# Altium project v7-9BProto-cpu.PrjPCB
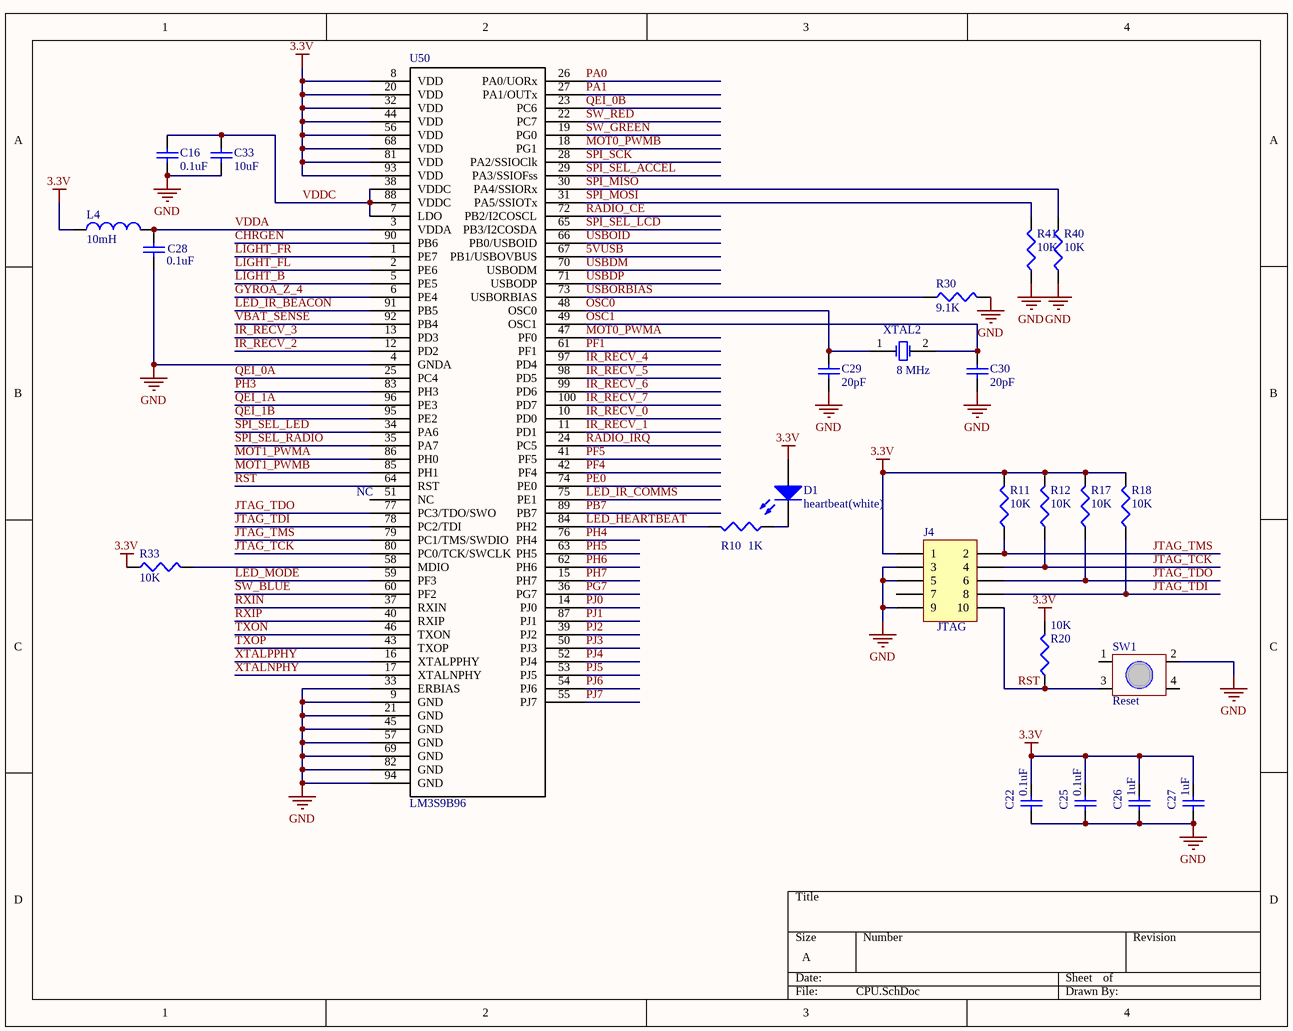
[diagram p0: CPU.SchDoc]
6 sheets, 133 parts. Net scope: global (net labels, ports and power ports of the same name join across sheets).
Board file: v0-9Bcpu.PcbDoc
Sheets:
  CPU.SchDoc
  USB_Headers.SchDoc
  IRComms.SchDoc
  LEDs.SchDoc
  Radio.SchDoc
  LightSensors_Buttons_LCD.SchDoc

## Sheet CPU.SchDoc
size A

### Parts
C16  value 0.1uF  [CAPC1005L]  (hidden comment: Cap Semi)
C22  value 0.1uF  [CAPC1005L]  (hidden comment: Cap Semi)
C25  value 0.1uF  [CAPC1005L]  (hidden comment: Cap Semi)
C26  value 1uF  [CAPC1608L]  (hidden comment: Cap Semi)
C27  value 1uF  [CAPC1608L]  (hidden comment: Cap Semi)
C28  value 0.1uF  [CAPC1005L]  (hidden comment: Cap Semi)
C29  value 20pF  [CAPC1005L]  (hidden comment: Cap Semi)
C30  value 20pF  [CAPC1005L]  (hidden comment: Cap Semi)
C33  value 10uF  [CAPC1005L]  (hidden comment: Cap Semi)
D1  heartbeat(white)  [INDC2012L]
J4  JTAG  [JTAG-10]
L4  value 10mH  [INDC2012L]  (hidden comment: Inductor)
R10  value 1K  [RESC1608L]  (hidden comment: Res3)
R11  value 10K  [RESC1608L]  (hidden comment: Res3)
R12  value 10K  [RESC1608L]  (hidden comment: Res3)
R17  value 10K  [RESC1608L]  (hidden comment: Res3)
R18  value 10K  [RESC1608L]  (hidden comment: Res3)
R20  value 10K  [RESC1608L]  (hidden comment: Res3)
R30  value 9.1K  [RESC1608L]  (hidden comment: Res3)
R33  value 10K  [RESC1608L]  (hidden comment: Res3)
R40  value 10K  [RESC1608L]  (hidden comment: Res3)
R41  value 10K  [RESC1608L]  (hidden comment: Res3)
SW1  Reset  [SwitchTall-TL330]
U50  LM3S9B96  [LQFP-100]
XTAL2  8 MHz  [RESC5025L]

### Nets
3.3V: C22.2 C25.2 C26.2 C27.2 D1.1(A) J4.1 L4.1 R11.2 R12.2 R17.2 R18.2 R20.2 R33.1 U50.8(VDD) U50.20(VDD) U50.32(VDD) U50.44(VDD) U50.56(VDD) U50.68(VDD) U50.81(VDD) U50.93(VDD)
GND: C16.1 C22.1 C25.1 C26.1 C27.1 C28.1 C29.1 C30.1 C33.1 J4.3 J4.5 J4.9 R30.2 R40.1 R41.1 SW1.2 U50.4(GNDA) U50.9(GND) U50.21(GND) U50.33(ERBIAS) U50.45(GND) U50.57(GND) U50.69(GND) U50.82(GND) U50.94(GND)
5VUSB: U50.67(PB1/USBOVBUS)
CHRGEN: U50.90(PB6)
GYROA_Z_4: U50.6(PE4)
IR_RECV_0: U50.10(PD0)
IR_RECV_1: U50.11(PD1)
IR_RECV_2: U50.12(PD2)
IR_RECV_3: U50.13(PD3)
IR_RECV_4: U50.97(PD4)
IR_RECV_5: U50.98(PD5)
IR_RECV_6: U50.99(PD6)
IR_RECV_7: U50.100(PD7)
JTAG_TCK: J4.4 R12.1 U50.80(PC0/TCK/SWCLK)
JTAG_TDI: J4.8 R18.1 U50.78(PC2/TDI)
JTAG_TDO: J4.6 R17.1 U50.77(PC3/TDO/SWO)
JTAG_TMS: J4.2 R11.1 U50.79(PC1/TMS/SWDIO)
LED_HEARTBEAT: R10.2 U50.84(PH2)
LED_IR_BEACON: U50.91(PB5)
LED_IR_COMMS: U50.75(PE1)
LED_MODE: U50.59(PF3)
LIGHT_B: U50.5(PE5)
LIGHT_FL: U50.2(PE6)
LIGHT_FR: U50.1(PE7)
MOT0_PWMA: U50.47(PF0)
MOT0_PWMB: U50.18(PG1)
MOT1_PWMA: U50.86(PH0)
MOT1_PWMB: U50.85(PH1)
OSC0: C29.2 U50.48(OSC0) XTAL2.1(OSC1)
OSC1: C30.2 U50.49(OSC1) XTAL2.2(OSC2)
PA0: U50.26(PA0/UORx)
PA1: U50.27(PA1/OUTx)
PB7: U50.89(PB7)
PE0: U50.74(PE0)
PF1: U50.61(PF1)
PF4: U50.42(PF4)
PF5: U50.41(PF5)
PG7: U50.36(PG7)
PH3: U50.83(PH3)
PH4: U50.76(PH4)
PH5: U50.63(PH5)
PH6: U50.62(PH6)
PH7: U50.15(PH7)
PJ0: U50.14(PJ0)
PJ1: U50.87(PJ1)
PJ2: U50.39(PJ2)
PJ3: U50.50(PJ3)
PJ4: U50.52(PJ4)
PJ5: U50.53(PJ5)
PJ6: U50.54(PJ6)
PJ7: U50.55(PJ7)
QEI_0A: U50.25(PC4)
QEI_0B: U50.23(PC6)
QEI_1A: U50.96(PE3)
QEI_1B: U50.95(PE2)
RADIO_CE: U50.72(PB2/I2COSCL)
RADIO_IRQ: U50.24(PC5)
RST: J4.10 R20.1 SW1.3 U50.64(RST)
RXIN: U50.37(RXIN)
RXIP: U50.40(RXIP)
SPI_MISO: R40.2 U50.30(PA4/SSIORx)
SPI_MOSI: R41.2 U50.31(PA5/SSIOTx)
SPI_SCK: U50.28(PA2/SSIOClk)
SPI_SEL_ACCEL: U50.29(PA3/SSIOFss)
SPI_SEL_LCD: U50.65(PB3/I2COSDA)
SPI_SEL_LED: U50.34(PA6)
SPI_SEL_RADIO: U50.35(PA7)
SW_BLUE: U50.60(PF2)
SW_GREEN: U50.19(PG0)
SW_RED: U50.22(PC7)
TXON: U50.46(TXON)
TXOP: U50.43(TXOP)
USBDM: U50.70(USBODM)
USBDP: U50.71(USBODP)
USBOID: U50.66(PB0/USBOID)
USBORBIAS: R30.1 U50.73(USBORBIAS)
VBAT_SENSE: U50.92(PB4)
VDDA: C28.2 L4.2 U50.3(VDDA)
VDDC: C16.2 C33.2 U50.7(LDO) U50.38(VDDC) U50.88(VDDC)
XTALNPHY: U50.17(XTALNPHY)
XTALPPHY: U50.16(XTALPPHY)
NetD1_2: D1.2(K) R10.1
NetR33_2: R33.2 U50.58(MDIO)

Not connected (* = marked no-connect by the designer): J4 7; SW1 1 4; U50 51(NC)

### Notes on the sheet
- (near U50) NC

### Library data of the parts
C16 C22 C25-C30 C33 = Cap Semi: Capacitor (Semiconductor SIM Model); Published: 8-Jun-2000; LatestRevisionDate: 29-May-2009; LatestRevisionNote: IPC-7351 Footprint Added.; PackageReference: C1206; Publisher: Altium Limited; PackageDescription: Chip Capacitor
D1 = LED2: Typical RED, GREEN, YELLOW, AMBER GaAs LED; Published: 8-Jun-2000; LatestRevisionDate: 17-Jul-2002; LatestRevisionNote: Re-released for DXP Platform.; PackageVersion: Feb-2002; PackageReference: 3.2X1.6X1.1; Publisher: Altium Limited
J4 = Header 5X2H: Header, 5-Pin, Dual row, Right Angle; LatestRevisionDate: 17-Jul-2002; LatestRevisionNote: Re-released for DXP Platform.; Publisher: Altium Limited
L4 = Inductor: Code_IEC: 1005; Published: 8-Jun-2000; LatestRevisionDate: 29-May-2009; LatestRevisionNote: IPC-7351 Footprint Added.; PackageReference: 0402-A; Publisher: Altium Limited; PackageDescription: Chip Inductor; Code_JEITA: 0402
R10-R12 R17 R18 R20 R30 R33 R40 R41 = Res3: Resistor; Published: 8-Jun-2000; LatestRevisionDate: 29-May-2009; LatestRevisionNote: IPC-7351 Footprint Added.; PackageReference: J1-0603; Publisher: Altium Limited; PackageDescription: Chip Resistor
SW1 = Switch-TL330
XTAL2 = XTAL: Crystal Oscillator; Published: 8-Jun-2000; LatestRevisionDate: 17-Jul-2002; LatestRevisionNote: Re-released for DXP Platform.; PackageReference: R38; Publisher: Altium Limited

## Sheet USB_Headers.SchDoc
size A
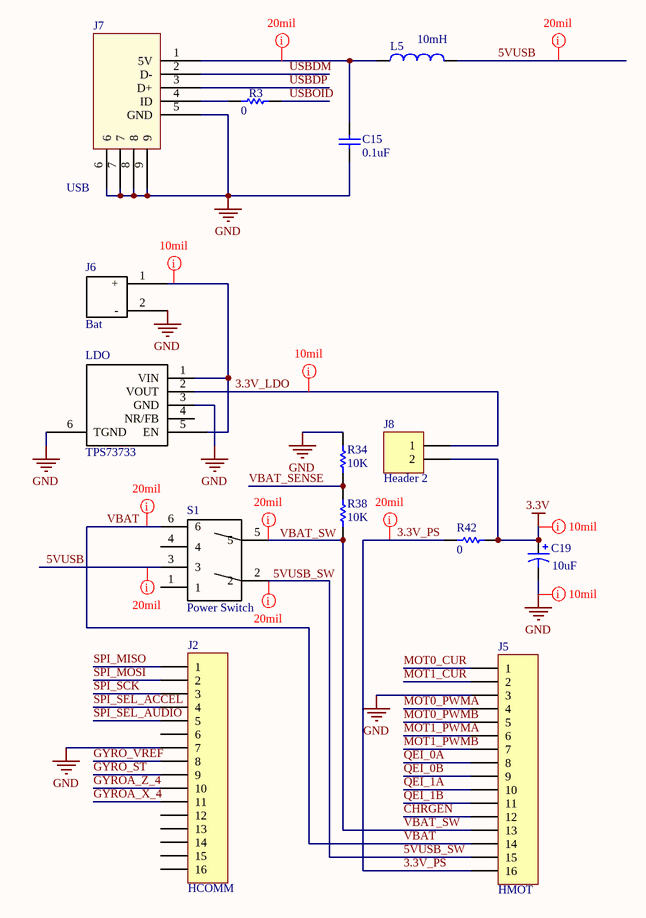
[diagram p1: USB_Headers.SchDoc]

### Parts
C15  value 0.1uF  [CAPC1005L]
C19  value 10uF  [CAPC3216L]  (hidden comment: Cap Pol3)
J2  HCOMM  [HDR1X16]
J5  HMOT  [HDR1X16]
J6  Bat  [BatteryConnJST]
J7  USB  [USB Minib (thru-hole)]
J8  Header 2  [HDR1X2]
L5  value 10mH  [INDC2012L]  (hidden comment: Inductor)
LDO  TPS73733  [SOT-223-5pin]
R3  value 0  [RESC1608L]
R34  value 10K  [RESC1608L]
R38  value 10K  [RESC1608L]
R42  value 0  [RESC3216L]
S1  Power Switch  [DPDTSwitch]

### Nets
3.3V: C19.1 J8.2 R42.2
GND: C15.1 C19.2 J2.7 J5.3 J6.2(-) J7.5(GND) J7.6 J7.7 J7.8 J7.9 LDO.3(GND) LDO.6(TGND) R34.2
3.3V_LDO: J8.1 LDO.2(VOUT)
3.3V_PS: J5.16 R42.1
5VUSB: L5.2 S1.3
5VUSB_SW: J5.15 S1.2
CHRGEN: J5.12
GYRO_ST: J2.9
GYRO_VREF: J2.8
GYROA_X_4: J2.11
GYROA_Z_4: J2.10
MOT0_CUR: J5.1
MOT0_PWMA: J5.4
MOT0_PWMB: J5.5
MOT1_CUR: J5.2
MOT1_PWMA: J5.6
MOT1_PWMB: J5.7
QEI_0A: J5.8
QEI_0B: J5.9
QEI_1A: J5.10
QEI_1B: J5.11
SPI_MISO: J2.1
SPI_MOSI: J2.2
SPI_SCK: J2.3
SPI_SEL_ACCEL: J2.4
SPI_SEL_AUDIO: J2.5
USBDM: J7.2(D-)
USBDP: J7.3(D+)
USBOID: R3.1
VBAT: J5.14 S1.6
VBAT_SENSE: R34.1 R38.2
VBAT_SW: J5.13 R38.1 S1.5
NetC15_2: C15.2 J7.1(5V) L5.1
NetJ6_1: J6.1(+) LDO.1(VIN) LDO.5(EN)
NetJ7_4: J7.4(ID) R3.2

Not connected (* = marked no-connect by the designer): J2 6 12 13 14 15 16; LDO 4(NR/FB); S1 1 4

### Layout directives
rule Width Constraint [Pref Width = 10mil    Min Width = 10mil    Max Width = 20mil]: 3.3V, 3.3V_PS, 5VUSB, 5VUSB_SW, GND, NetC15_2, VBAT, VBAT_SW
rule Width Constraint [Pref Width = 10mil    Min Width = 10mil    Max Width = 10mil]: 3.3V_LDO, NetJ6_1

### Notes on the sheet
- Labels drawn without touching a wire or pin: 5VUSB_SW, VBAT_SW

### Library data of the parts
C15 = Cap: Capacitor; Published: 8-Jun-2000; LatestRevisionDate: 17-Jul-2002; LatestRevisionNote: Re-released for DXP Platform.; PackageReference: RAD-0.3; Publisher: Altium Limited
C19 = Cap Pol3: Polarized Capacitor (Surface Mount); Published: 8-Jun-2000; LatestRevisionDate: 29-May-2009; LatestRevisionNote: IPC-7351 Footprint Added.; PackageReference: C0805; Publisher: Altium Limited; PackageDescription: Chip Capacitor
J2 J5 = Header 16: Header, 16-Pin; LatestRevisionDate: 17-Jul-2002; LatestRevisionNote: Re-released for DXP Platform.; Publisher: Altium Limited
J6 = BatteryConnJST
J7 = USB-ConnTH
J8 = Header 2: Header, 2-Pin; LatestRevisionDate: 17-Jul-2002; LatestRevisionNote: Re-released for DXP Platform.; Publisher: Altium Limited
L5 = Inductor: Code_IEC: 1005; Published: 8-Jun-2000; LatestRevisionDate: 29-May-2009; LatestRevisionNote: IPC-7351 Footprint Added.; PackageReference: 0402-A; Publisher: Altium Limited; PackageDescription: Chip Inductor; Code_JEITA: 0402
LDO = LDO33-TI-TPS73733
R3 R34 R38 R42 = Res1: Resistor; Published: 8-Jun-2000; LatestRevisionDate: 17-Jul-2002; LatestRevisionNote: Re-released for DXP Platform.; PackageReference: AXIAL-0.3; Publisher: Altium Limited
S1 = DPDTSwitch

## Sheet IRComms.SchDoc
size A
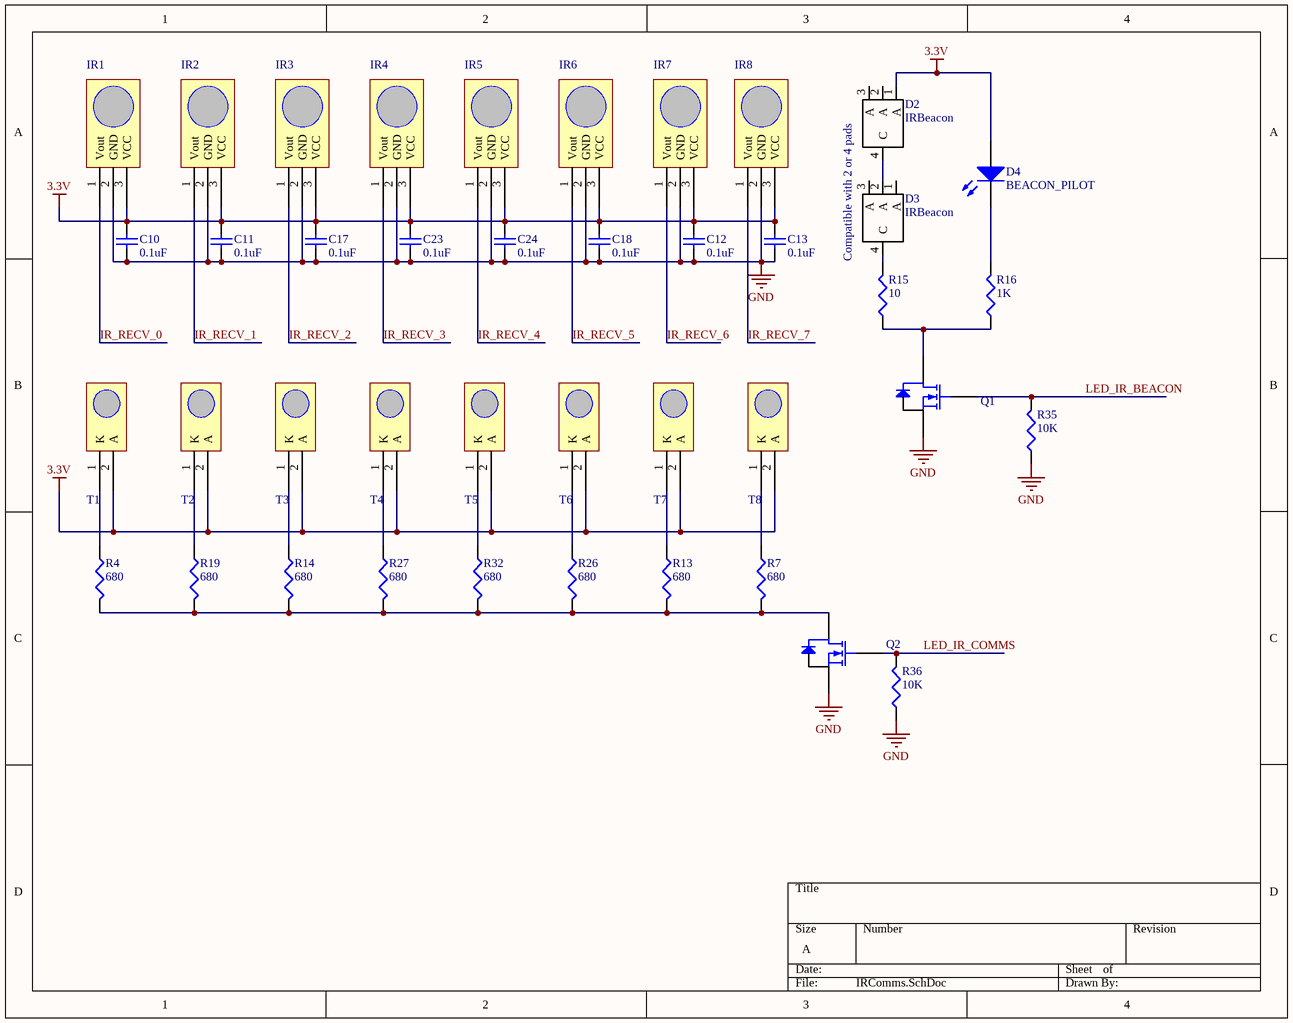
[diagram p2: IRComms.SchDoc]

### Parts
C10  value 0.1uF  [CAPC1005L]  (hidden comment: Cap Semi)
C11  value 0.1uF  [CAPC1005L]  (hidden comment: Cap Semi)
C12  value 0.1uF  [CAPC1005L]  (hidden comment: Cap Semi)
C13  value 0.1uF  [CAPC1005L]  (hidden comment: Cap Semi)
C17  value 0.1uF  [CAPC1005L]  (hidden comment: Cap Semi)
C18  value 0.1uF  [CAPC1005L]  (hidden comment: Cap Semi)
C23  value 0.1uF  [CAPC1005L]  (hidden comment: Cap Semi)
C24  value 0.1uF  [CAPC1005L]  (hidden comment: Cap Semi)
D2  IRBeacon  [IRBeacon]
D3  IRBeacon  [IRBeacon]
D4  BEACON_PILOT  [SurfaceMount(603)]
IR1  GP1UX31QS  [GP1UX31QS]  (value not drawn)
IR2  GP1UX31QS  [GP1UX31QS]  (value not drawn)
IR3  GP1UX31QS  [GP1UX31QS]  (value not drawn)
IR4  GP1UX31QS  [GP1UX31QS]  (value not drawn)
IR5  GP1UX31QS  [GP1UX31QS]  (value not drawn)
IR6  GP1UX31QS  [GP1UX31QS]  (value not drawn)
IR7  GP1UX31QS  [GP1UX31QS]  (value not drawn)
IR8  GP1UX31QS  [GP1UX31QS]  (value not drawn)
Q1  Mosfet  [SOT-23]  (value not drawn)
Q2  Mosfet  [SOT-23]  (value not drawn)
R4  value 680  [RESC1608L]  (hidden comment: Res3)
R7  value 680  [RESC1608L]  (hidden comment: Res3)
R13  value 680  [RESC1608L]  (hidden comment: Res3)
R14  value 680  [RESC1608L]  (hidden comment: Res3)
R15  value 10  [RESC1608L]  (hidden comment: Res3)
R16  value 1K  [RESC1608L]  (hidden comment: Res3)
R19  value 680  [RESC1608L]  (hidden comment: Res3)
R26  value 680  [RESC1608L]  (hidden comment: Res3)
R27  value 680  [RESC1608L]  (hidden comment: Res3)
R32  value 680  [RESC1608L]  (hidden comment: Res3)
R35  value 10K  [RESC1608L]  (hidden comment: Res3)
R36  value 10K  [RESC1608L]  (hidden comment: Res3)
T1  LN54  [LN54]  (value not drawn)
T2  LN54  [LN54]  (value not drawn)
T3  LN54  [LN54]  (value not drawn)
T4  LN54  [LN54]  (value not drawn)
T5  LN54  [LN54]  (value not drawn)
T6  LN54  [LN54]  (value not drawn)
T7  LN54  [LN54]  (value not drawn)
T8  LN54  [LN54]  (value not drawn)

### Nets
3.3V: C10.2 C11.2 C12.2 C13.2 C17.2 C18.2 C23.2 C24.2 D2.1(A) D4.1(A) IR1.3(VCC) IR2.3(VCC) IR3.3(VCC) IR4.3(VCC) IR5.3(VCC) IR6.3(VCC) IR7.3(VCC) IR8.3(VCC) T1.2(A) T2.2(A) T3.2(A) T4.2(A) T5.2(A) T6.2(A) T7.2(A) T8.2(A)
GND: C10.1 C11.1 C12.1 C13.1 C17.1 C18.1 C23.1 C24.1 IR1.2(GND) IR2.2(GND) IR3.2(GND) IR4.2(GND) IR5.2(GND) IR6.2(GND) IR7.2(GND) IR8.2(GND) Q1.2(S) Q2.2(S) R35.1 R36.1
IR_RECV_0: IR1.1(Vout)
IR_RECV_1: IR2.1(Vout)
IR_RECV_2: IR3.1(Vout)
IR_RECV_3: IR4.1(Vout)
IR_RECV_4: IR5.1(Vout)
IR_RECV_5: IR6.1(Vout)
IR_RECV_6: IR7.1(Vout)
IR_RECV_7: IR8.1(Vout)
LED_IR_BEACON: Q1.1(G) R35.2
LED_IR_COMMS: Q2.1(G) R36.2
NetD2_4: D2.4(C) D3.2(A)
NetD3_4: D3.4(C) R15.2
NetD4_2: D4.2(K) R16.2
NetQ1_3: Q1.3(D) R15.1 R16.1
NetQ2_3: Q2.3(D) R4.2 R7.2 R13.2 R14.2 R19.2 R26.2 R27.2 R32.2
NetR4_1: R4.1 T1.1(K)
NetR7_1: R7.1 T8.1(K)
NetR13_1: R13.1 T7.1(K)
NetR14_1: R14.1 T3.1(K)
NetR19_1: R19.1 T2.1(K)
NetR26_1: R26.1 T6.1(K)
NetR27_1: R27.1 T4.1(K)
NetR32_1: R32.1 T5.1(K)

Not connected (* = marked no-connect by the designer): D2 2(A) 3(A); D3 1(A) 3(A)

### Notes on the sheet
- Compatible with 2 or 4 pads

### Library data of the parts
C10-C13 C17 C18 C23 C24 = Cap Semi: Capacitor (Semiconductor SIM Model); Published: 8-Jun-2000; LatestRevisionDate: 29-May-2009; LatestRevisionNote: IPC-7351 Footprint Added.; PackageReference: C1206; Publisher: Altium Limited; PackageDescription: Chip Capacitor
D4 = LED
R4 R7 R13-R16 R19 R26 R27 R32 R35 R36 = Res3: Resistor; Published: 8-Jun-2000; LatestRevisionDate: 29-May-2009; LatestRevisionNote: IPC-7351 Footprint Added.; PackageReference: J1-0603; Publisher: Altium Limited; PackageDescription: Chip Resistor

## Sheet LEDs.SchDoc
size A
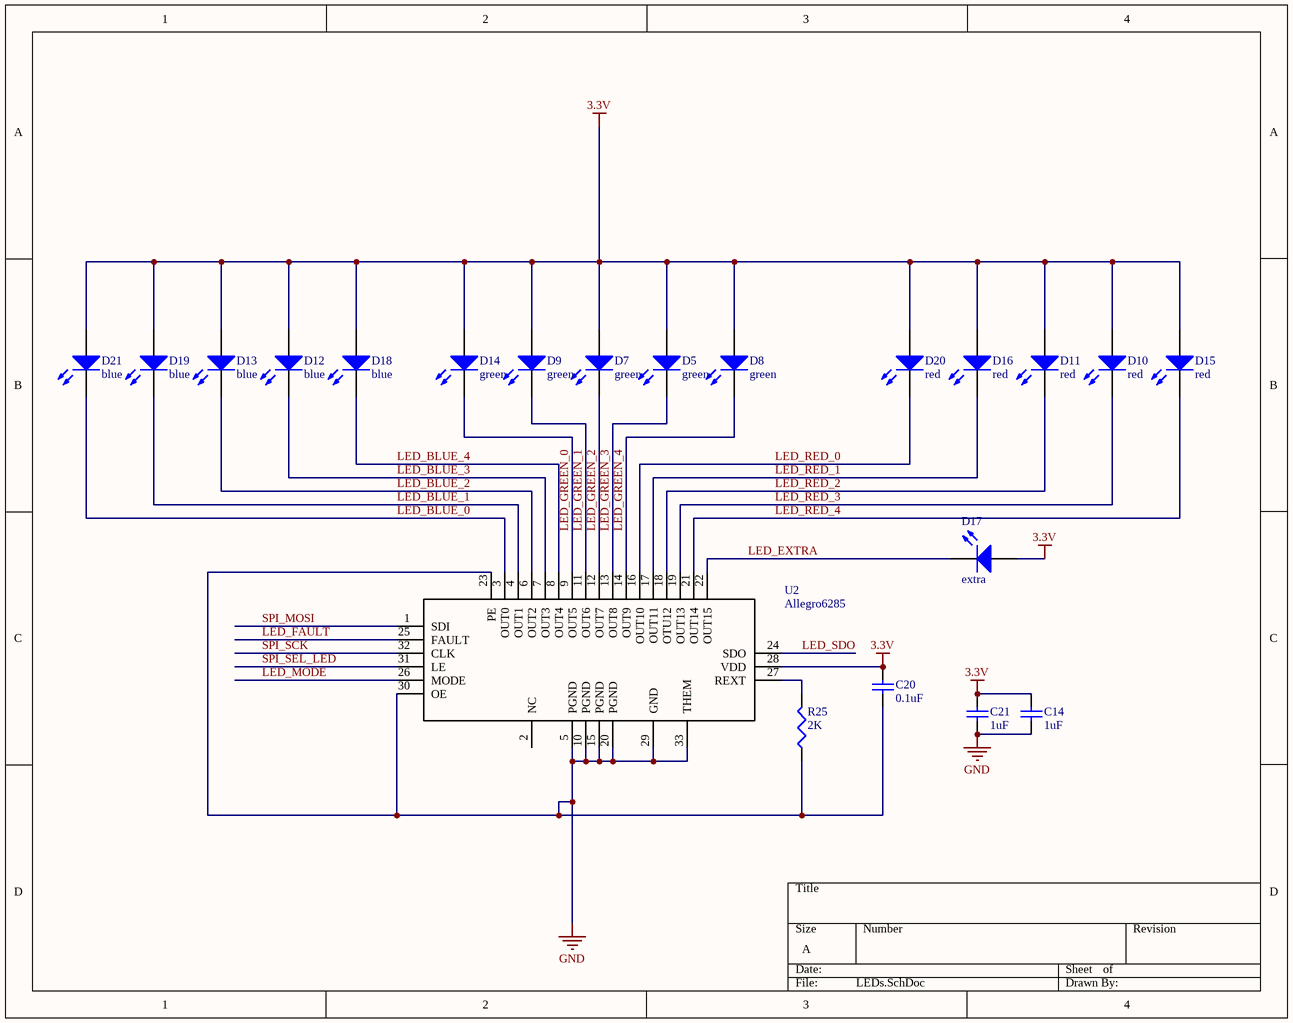
[diagram p3: LEDs.SchDoc]

### Parts
C14  value 1uF  [CAPC1608L]  (hidden comment: Cap Semi)
C20  value 0.1uF  [CAPC1005L]  (hidden comment: Cap Semi)
C21  value 1uF  [CAPC1608L]  (hidden comment: Cap Semi)
D5  green  [SurfaceMount(603)]
D7  green  [SurfaceMount(603)]
D8  green  [SurfaceMount(603)]
D9  green  [SurfaceMount(603)]
D10  red  [SurfaceMount(603)]
D11  red  [SurfaceMount(603)]
D12  blue  [SurfaceMount(603)]
D13  blue  [SurfaceMount(603)]
D14  green  [SurfaceMount(603)]
D15  red  [SurfaceMount(603)]
D16  red  [SurfaceMount(603)]
D17  extra  [SurfaceMount(603)]
D18  blue  [SurfaceMount(603)]
D19  blue  [SurfaceMount(603)]
D20  red  [SurfaceMount(603)]
D21  blue  [SurfaceMount(603)]
R25  value 2K  [RESC1608L]  (hidden comment: Res3)
U2  Allegro6285  [QFN-32]

### Nets
3.3V: C14.2 C20.2 C21.2 D5.1(A) D7.1(A) D8.1(A) D9.1(A) D10.1(A) D11.1(A) D12.1(A) D13.1(A) D14.1(A) D15.1(A) D16.1(A) D17.1(A) D18.1(A) D19.1(A) D20.1(A) D21.1(A) U2.28(VDD)
GND: C14.1 C20.1 C21.1 R25.1 U2.5(PGND) U2.10(PGND) U2.15(PGND) U2.20(PGND) U2.23(PE) U2.29(GND) U2.30(OE) U2.33(THEM)
LED_BLUE_0: D21.2(K) U2.3(OUT0)
LED_BLUE_1: D19.2(K) U2.4(OUT1)
LED_BLUE_2: D13.2(K) U2.6(OUT2)
LED_BLUE_3: D12.2(K) U2.7(OUT3)
LED_BLUE_4: D18.2(K) U2.8(OUT4)
LED_EXTRA: D17.2(K) U2.22(OUT15)
LED_FAULT: U2.25(FAULT)
LED_GREEN_0: D14.2(K) U2.9(OUT5)
LED_GREEN_1: D9.2(K) U2.11(OUT6)
LED_GREEN_2: D7.2(K) U2.12(OUT7)
LED_GREEN_3: D5.2(K) U2.13(OUT8)
LED_GREEN_4: D8.2(K) U2.14(OUT9)
LED_MODE: U2.26(MODE)
LED_RED_0: D20.2(K) U2.16(OUT10)
LED_RED_1: D16.2(K) U2.17(OUT11)
LED_RED_2: D11.2(K) U2.18(OTU12)
LED_RED_3: D10.2(K) U2.19(OUT13)
LED_RED_4: D15.2(K) U2.21(OUT14)
LED_SDO: U2.24(SDO)
SPI_MOSI: U2.1(SDI)
SPI_SCK: U2.32(CLK)
SPI_SEL_LED: U2.31(LE)
NetR25_2: R25.2 U2.27(REXT)

Not connected (* = marked no-connect by the designer): U2 2(NC)

### Library data of the parts
C14 C20 C21 = Cap Semi: Capacitor (Semiconductor SIM Model); Published: 8-Jun-2000; LatestRevisionDate: 29-May-2009; LatestRevisionNote: IPC-7351 Footprint Added.; PackageReference: C1206; Publisher: Altium Limited; PackageDescription: Chip Capacitor
D5 D7-D21 = LED
R25 = Res3: Resistor; Published: 8-Jun-2000; LatestRevisionDate: 29-May-2009; LatestRevisionNote: IPC-7351 Footprint Added.; PackageReference: J1-0603; Publisher: Altium Limited; PackageDescription: Chip Resistor

## Sheet Radio.SchDoc
size A
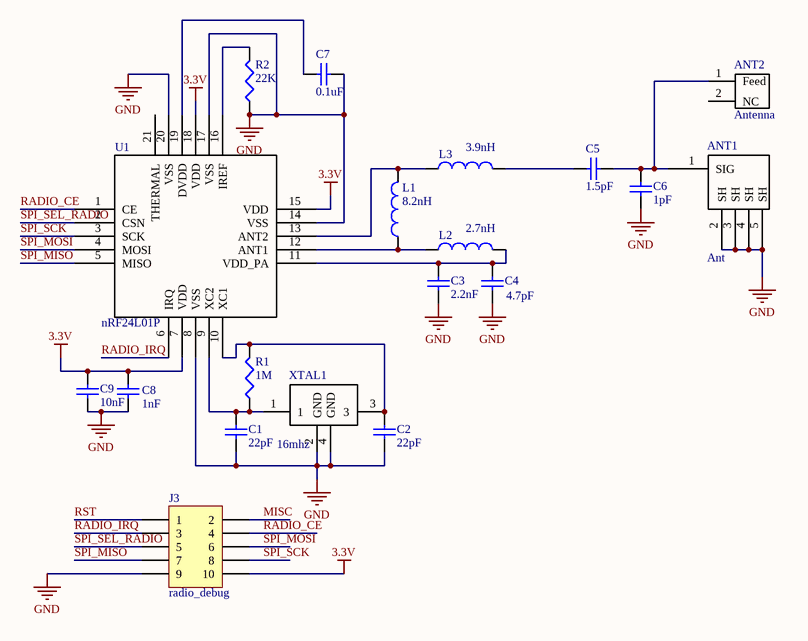
[diagram p4: Radio.SchDoc]

### Parts
ANT1  Ant  [AntennaSMA]
ANT2  Antenna  [antenna]
C1  value 22pF  [CAPC1005L]  (hidden comment: Cap Semi)
C2  value 22pF  [CAPC1005L]  (hidden comment: Cap Semi)
C3  value 2.2nF  [CAPC1005L]  (hidden comment: Cap Semi)
C4  value 4.7pF  [CAPC1005L]  (hidden comment: Cap Semi)
C5  value 1.5pF  [CAPC1005L]  (hidden comment: Cap Semi)
C6  value 1pF  [CAPC1005L]  (hidden comment: Cap Semi)
C7  value 0.1uF  [CAPC1005L]  (hidden comment: Cap Semi)
C8  value 1nF  [CAPC1005L]  (hidden comment: Cap Semi)
C9  value 10nF  [CAPC1005L]  (hidden comment: Cap Semi)
J3  radio_debug  [HDR2X5]
L1  value 8.2nH  [INDC1005AL]  (hidden comment: Inductor)
L2  value 2.7nH  [INDC1005AL]  (hidden comment: Inductor)
L3  value 3.9nH  [INDC1005AL]  (hidden comment: Inductor)
R1  value 1M  [RESC1608L]  (hidden comment: Res3)
R2  value 22K  [RESC1608L]  (hidden comment: Res3)
U1  nRF24L01P  [QFN-20]
XTAL1  value 16mhz  [RadioCrystal]  (hidden comment: RADIO CRYSTAL)

### Nets
3.3V: C8.2 C9.2 J3.10 U1.7(VDD) U1.15(VDD) U1.18(VDD)
GND: ANT1.2(SH) ANT1.3(SH) ANT1.4(SH) ANT1.5(SH) C1.1 C2.1 C3.1 C4.1 C6.1 C7.1 C8.1 C9.1 J3.9 R2.1 U1.8(VSS) U1.14(VSS) U1.17(VSS) U1.20(VSS) XTAL1.2(GND) XTAL1.4(GND)
MISC: J3.2
RADIO_CE: J3.4 U1.1(CE)
RADIO_IRQ: J3.3 U1.6(IRQ)
RST: J3.1
SPI_MISO: J3.7 U1.5(MISO)
SPI_MOSI: J3.6 U1.4(MOSI)
SPI_SCK: J3.8 U1.3(SCK)
SPI_SEL_RADIO: J3.5 U1.2(CSN)
NetANT1_1: ANT1.1(SIG) ANT2.1(Feed) C5.1 C6.2
NetC1_2: C1.2 R1.1 U1.9(XC2) XTAL1.1
NetC2_2: C2.2 R1.2 U1.10(XC1) XTAL1.3
NetC3_2: C3.2 C4.2 L2.2 U1.11(VDD_PA)
NetC5_2: C5.2 L3.2
NetC7_2: C7.2 U1.19(DVDD)
NetL1_1: L1.1 L2.1 U1.12(ANT1)
NetL1_2: L1.2 L3.1 U1.13(ANT2)
NetR2_2: R2.2 U1.16(IREF)

Not connected (* = marked no-connect by the designer): ANT2 2(NC); U1 21(THERMAL)

### Library data of the parts
ANT1 = AntennaConn
C1-C9 = Cap Semi: Capacitor (Semiconductor SIM Model); Published: 8-Jun-2000; LatestRevisionDate: 29-May-2009; LatestRevisionNote: IPC-7351 Footprint Added.; PackageReference: C1206; Publisher: Altium Limited; PackageDescription: Chip Capacitor
J3 = Header 5X2: Header, 5-Pin, Dual row; LatestRevisionDate: 17-Jul-2002; LatestRevisionNote: Re-released for DXP Platform.; Publisher: Altium Limited
L1-L3 = Inductor: Code_IEC: 1005; Published: 8-Jun-2000; LatestRevisionDate: 29-May-2009; LatestRevisionNote: IPC-7351 Footprint Added.; PackageReference: 0402-A; Publisher: Altium Limited; PackageDescription: Chip Inductor; Code_JEITA: 0402
R1 R2 = Res3: Resistor; Published: 8-Jun-2000; LatestRevisionDate: 29-May-2009; LatestRevisionNote: IPC-7351 Footprint Added.; PackageReference: J1-0603; Publisher: Altium Limited; PackageDescription: Chip Resistor
U1 = radio-nRF24L01P
XTAL1 = RadioCrystal

## Sheet LightSensors_Buttons_LCD.SchDoc
size A
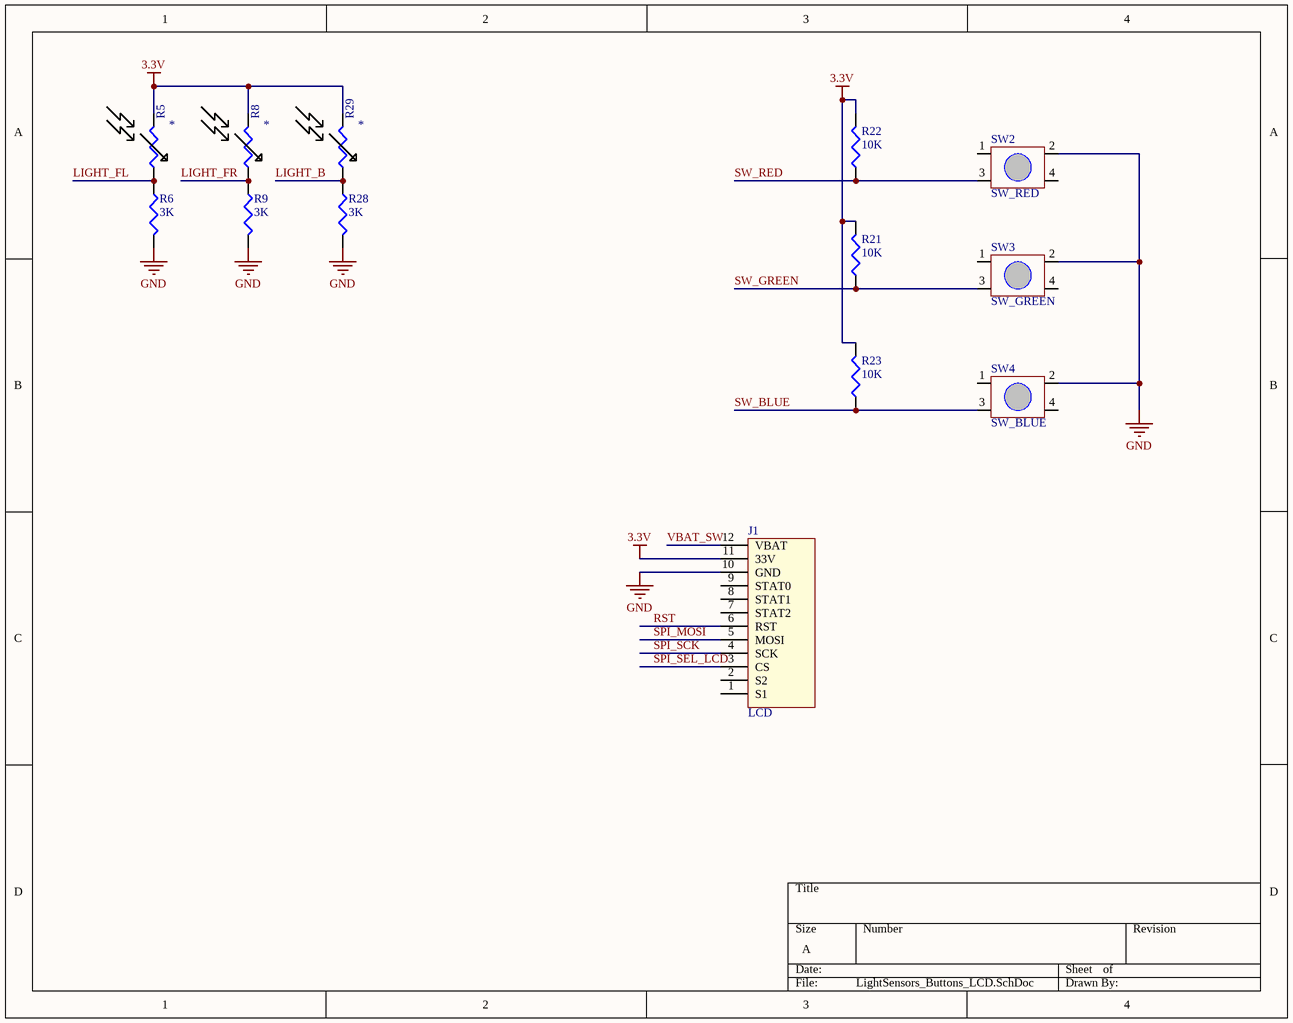
[diagram p5: LightSensors_Buttons_LCD.SchDoc]

### Parts
J1  LCD  [LCD-6100breakout]
R5  photoresistor  [photoresistor]  (value not drawn)
R6  value 3K  [RESC1608L]  (hidden comment: Res3)
R8  photoresistor  [photoresistor]  (value not drawn)
R9  value 3K  [RESC1608L]  (hidden comment: Res3)
R21  value 10K  [RESC1608L]  (hidden comment: Res3)
R22  value 10K  [RESC1608L]  (hidden comment: Res3)
R23  value 10K  [RESC1608L]  (hidden comment: Res3)
R28  value 3K  [RESC1608L]  (hidden comment: Res3)
R29  photoresistor  [photoresistor]  (value not drawn)
SW2  SW_RED  [SwitchTall-TL330]
SW3  SW_GREEN  [SwitchTall-TL330]
SW4  SW_BLUE  [SwitchTall-TL330]

### Nets
3.3V: J1.11(33V) R5.2 R8.2 R21.2 R22.2 R23.2 R29.2
GND: J1.10(GND) R6.2 R9.2 R28.2 SW2.2 SW3.2 SW4.2
LIGHT_B: R28.1 R29.1
LIGHT_FL: R5.1 R6.1
LIGHT_FR: R8.1 R9.1
RST: J1.6(RST)
SPI_MOSI: J1.5(MOSI)
SPI_SCK: J1.4(SCK)
SPI_SEL_LCD: J1.3(CS)
SW_BLUE: R23.1 SW4.3
SW_GREEN: R21.1 SW3.3
SW_RED: R22.1 SW2.3
VBAT_SW: J1.12(VBAT)

Not connected (* = marked no-connect by the designer): J1 1(S1) 2(S2) 7(STAT2) 8(STAT1) 9(STAT0); SW2 1 4; SW3 1 4; SW4 1 4

### Library data of the parts
J1 = LCD-NokiaBreakout
R6 R9 R21-R23 R28 = Res3: Resistor; Published: 8-Jun-2000; LatestRevisionDate: 29-May-2009; LatestRevisionNote: IPC-7351 Footprint Added.; PackageReference: J1-0603; Publisher: Altium Limited; PackageDescription: Chip Resistor
SW2-SW4 = Switch-TL330
R5 R8 R29 = photoresistor: Value: *

## Nets that join several sheets
3.3V: CPU (21 pins), USB_Headers (C19.1 J8.2 R42.2), IRComms (26 pins), LEDs (20 pins), Radio (6 pins), LightSensors_Buttons_LCD (7 pins)
GND: CPU (25 pins), USB_Headers (13 pins), IRComms (20 pins), LEDs (12 pins), Radio (20 pins), LightSensors_Buttons_LCD (7 pins)
5VUSB: CPU (U50.67), USB_Headers (L5.2 S1.3)
CHRGEN: CPU (U50.90), USB_Headers (J5.12)
GYROA_Z_4: CPU (U50.6), USB_Headers (J2.10)
IR_RECV_0: CPU (U50.10), IRComms (IR1.1)
IR_RECV_1: CPU (U50.11), IRComms (IR2.1)
IR_RECV_2: CPU (U50.12), IRComms (IR3.1)
IR_RECV_3: CPU (U50.13), IRComms (IR4.1)
IR_RECV_4: CPU (U50.97), IRComms (IR5.1)
IR_RECV_5: CPU (U50.98), IRComms (IR6.1)
IR_RECV_6: CPU (U50.99), IRComms (IR7.1)
IR_RECV_7: CPU (U50.100), IRComms (IR8.1)
LED_IR_BEACON: CPU (U50.91), IRComms (Q1.1 R35.2)
LED_IR_COMMS: CPU (U50.75), IRComms (Q2.1 R36.2)
LED_MODE: CPU (U50.59), LEDs (U2.26)
LIGHT_B: CPU (U50.5), LightSensors_Buttons_LCD (R28.1 R29.1)
LIGHT_FL: CPU (U50.2), LightSensors_Buttons_LCD (R5.1 R6.1)
LIGHT_FR: CPU (U50.1), LightSensors_Buttons_LCD (R8.1 R9.1)
MOT0_PWMA: CPU (U50.47), USB_Headers (J5.4)
MOT0_PWMB: CPU (U50.18), USB_Headers (J5.5)
MOT1_PWMA: CPU (U50.86), USB_Headers (J5.6)
MOT1_PWMB: CPU (U50.85), USB_Headers (J5.7)
QEI_0A: CPU (U50.25), USB_Headers (J5.8)
QEI_0B: CPU (U50.23), USB_Headers (J5.9)
QEI_1A: CPU (U50.96), USB_Headers (J5.10)
QEI_1B: CPU (U50.95), USB_Headers (J5.11)
RADIO_CE: CPU (U50.72), Radio (J3.4 U1.1)
RADIO_IRQ: CPU (U50.24), Radio (J3.3 U1.6)
RST: CPU (J4.10 R20.1 SW1.3 U50.64), Radio (J3.1), LightSensors_Buttons_LCD (J1.6)
SPI_MISO: CPU (R40.2 U50.30), USB_Headers (J2.1), Radio (J3.7 U1.5)
SPI_MOSI: CPU (R41.2 U50.31), USB_Headers (J2.2), LEDs (U2.1), Radio (J3.6 U1.4), LightSensors_Buttons_LCD (J1.5)
SPI_SCK: CPU (U50.28), USB_Headers (J2.3), LEDs (U2.32), Radio (J3.8 U1.3), LightSensors_Buttons_LCD (J1.4)
SPI_SEL_ACCEL: CPU (U50.29), USB_Headers (J2.4)
SPI_SEL_LCD: CPU (U50.65), LightSensors_Buttons_LCD (J1.3)
SPI_SEL_LED: CPU (U50.34), LEDs (U2.31)
SPI_SEL_RADIO: CPU (U50.35), Radio (J3.5 U1.2)
SW_BLUE: CPU (U50.60), LightSensors_Buttons_LCD (R23.1 SW4.3)
SW_GREEN: CPU (U50.19), LightSensors_Buttons_LCD (R21.1 SW3.3)
SW_RED: CPU (U50.22), LightSensors_Buttons_LCD (R22.1 SW2.3)
USBDM: CPU (U50.70), USB_Headers (J7.2)
USBDP: CPU (U50.71), USB_Headers (J7.3)
USBOID: CPU (U50.66), USB_Headers (R3.1)
VBAT_SENSE: CPU (U50.92), USB_Headers (R34.1 R38.2)
VBAT_SW: USB_Headers (J5.13 R38.1 S1.5), LightSensors_Buttons_LCD (J1.12)